# Altium project Hydra A1 UCLO 35131D.PrjPCB (part 6 of 14)
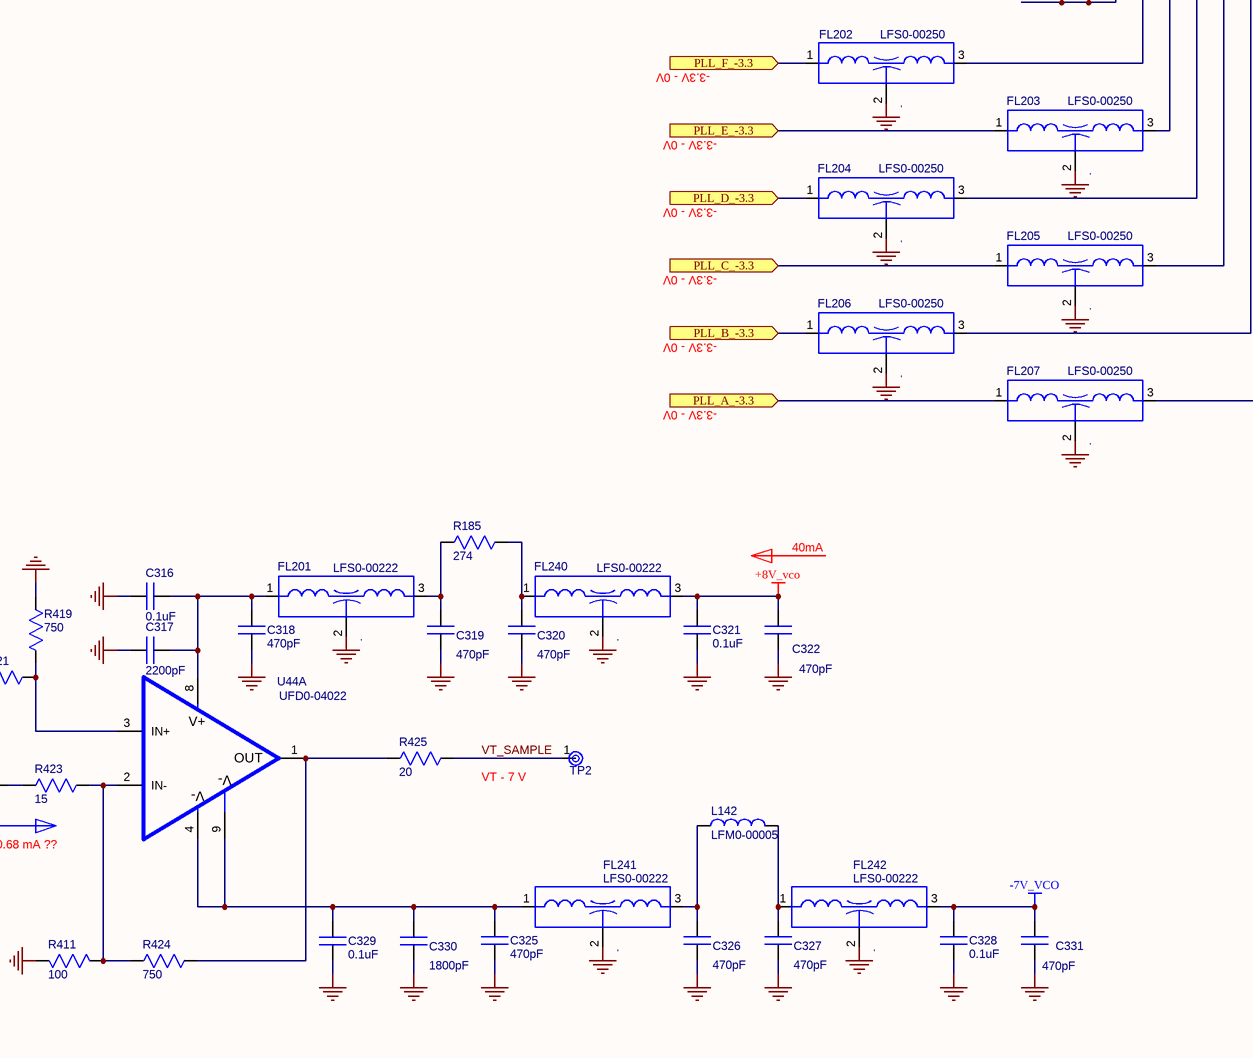
[diagram p73: Fast PLL.SchDoc, bottom right]

## Sheet Fast PLL.SchDoc: Fast PLL (continued)

### Library data of the parts
AT20 = MPFC-A1000: NoLoad: .; Approved: CL; M_PN: IMS1141-00DB; MFGR: IMS RESISTORS; level: 1; line_number: 50; ModifyDate: 4/16/13; G_PN: MPFC-A1000; item_number: MPFC-A1000
AT21 = MPFC-A1820: NoLoad: .; Approved: CL; MFGR: Aeroflex/Inmet; level: 1; line_number: 32; ModifyDate: 1/20/15; M_PN: MPFC-A1820; G_PN: MPFC-A1820; item_number: MPFC-A1820
C22 C294 C303 C461 = CK35-01470: MFGR: VENKEL; M_PN: C0201X7R250-471JNP; Approved: CL; NoLoad: .; level: 1; line_number: 112; ModifyDate: 7/23/13; G_PN: CK35-01470; item_number: CK35-01470
C23 C26 C30 C170 C223 C224 C229 C264 C270 C271 C273 C278 C280 C287 C289 C300 C302 C319 C320 C322 C326 C327 C331 C414 C415 C417 C462-C464 C1239 = CK40-01470: MFGR: Any; Approved: CL; NoLoad: .; level: 1; line_number: 75; ModifyDate: 02/22/12; M_PN: Any; G_PN: CK40-01470; item_number: CK40-01470
C27 C43 C44 C68 C92 C99 C127 C169 C221 C225 C228 C262 C275 C281 C288 C297 C298 C306 C307 C310 C311 C315 C316 C321 C323 C328 C329 C362 C458 C459 C468 C470 C1210 = CK40-04100: Approved: CL; NoLoad: .; MFGR: VENKEL; M_PN: C0402X7R160-104KNP; level: 1; line_number: 95; ModifyDate: 3/29/13; G_PN: CK40-04100; item_number: CK40-04100
C31 C32 C42 C75 C98 C226 C244 C246 C269 C291 C299 C304 C313 C314 C363 C465 C467 C471 = CK40-01470: Approved: CL; NoLoad: .; MFGR: Any; level: 1; line_number: 75; G_PN: CK40-01470; ModifyDate: 02/22/12; M_PN: Any; item_number: CK40-01470
C33 C36 C39 C52 C53 C337 = CK41-00015: Approved: CL; NoLoad: .; M_PN: 600L1R5AT200; MFGR: ATC; level: 1; line_number: 170; G_PN: CK41-00015; ModifyDate: 02/09/13; item_number: CK41-00015
C34 C37 C46 C335 = CK41-00018: Approved: CL; NoLoad: .; M_PN: 600L1R8AT200; MFGR: ATC; level: 1; line_number: 175; G_PN: CK41-00018; ModifyDate: 02/09/13; item_number: CK41-00018
C35 C38 C332 C336 = CK41-00082: Approved: CL; NoLoad: .; M_PN: 600L8R2BT200; MFGR: ATC; level: 1; line_number: 180; G_PN: CK41-00082; ModifyDate: 4/23/12; item_number: CK41-00082
C40 C49 C50 C333 = CK41-00012: Approved: CL; NoLoad: .; M_PN: 600L1R2AT200; MFGR: ATC; level: 1; line_number: 195; G_PN: CK41-00012; ModifyDate: 02/22/13; item_number: CK41-00012
C41 C47 = CK41-00091: Approved: CL; NoLoad: .; M_PN: 600L9R1BT200; MFGR: ATC; level: 1; line_number: 200; G_PN: CK41-00091; ModifyDate: 3/221/12; item_number: CK41-00091
C45 C48 C334 = CK41-00068: Approved: CL; NoLoad: .; M_PN: 600L6R8BT200; MFGR: ATC; level: 1; line_number: 210; G_PN: CK41-00068; ModifyDate: 02/22/12; item_number: CK41-00068
C54-C56 C58 C339 = CK41-00006: Approved: CL; NoLoad: .; M_PN: 600L0R6AT200; MFGR: ATC; level: 1; line_number: 225; G_PN: CK41-00006; ModifyDate: 02/22/12; item_number: CK41-00006
C57 C338 = CK41-00008: Approved: CL; NoLoad: .; M_PN: 600L0R8AT200; MFGR: ATC; level: 1; line_number: 230; G_PN: CK41-00008; ModifyDate: 02/20/13; item_number: CK41-00008
C161 C364 C397 C1101 = CK35-00270: Approved: CL; NoLoad: .; MFGR: VENKEL; M_PN: C0201C0G500-270JNP; level: 1; line_number: 97; G_PN: CK35-00270; ModifyDate: 8/2/13; item_number: CK35-00270
C163 C406-C409 C418 = CK40-00270: Approved: CL; NoLoad: .; MFGR: ANY; level: 1; line_number: 215; G_PN: CK40-00270; ModifyDate: 02/22/12; M_PN: ANY; item_number: CK40-00270
C167 C242 C263 C272 C292 C305 C410 C411 C413 C460 C466 C1209 = CK45-14100: Approved: CL; NoLoad: .; MFGR: VENKEL; M_PN: C0603X7R500-104JNE; level: 1; line_number: 65; ModifyDate: 3/29/13; G_PN: CK45-14100; item_number: CK45-14100
C168 C266 C268 C277 C318 C325 C383 C384 C386 C404 C405 C442-C444 C455-C457 = CK35-01470: Approved: CL; NoLoad: .; MFGR: VENKEL; M_PN: C0201X7R250-471JNP; level: 1; line_number: 112; ModifyDate: 7/23/13; G_PN: CK35-01470; item_number: CK35-01470
C174 = CK40-01150: Approved: CL; NoLoad: .; MFGR: Any; level: 1; line_number: 100; G_PN: CK40-01150; ModifyDate: 2/1/14; M_PN: Any; item_number: CK40-01150
C219 C220 = CK40-00100: NoLoad: .; MFGR: ANY; Approved: CL; level: 1; line_number: 110; G_PN: CK40-00100; ModifyDate: 4/9/12; M_PN: ANY; item_number: CK40-00100
C243 C265 C267 C276 C296 C330 = CK40-02180: Approved: CL; NoLoad: .; MFGR: Any; level: 1; line_number: 135; G_PN: CK40-02180; ModifyDate: 02/22/12; M_PN: Any; item_number: CK40-02180
C247 C249 = CK41-00003: Approved: CL; NoLoad: .; M_PN: 600L0R3AT200T; MFGR: ATC; level: 1; line_number: 140; G_PN: CK41-00003; ModifyDate: 01/23/14; item_number: CK41-00003
C248 C250 C274 C282 C284 = CK41-00002: Approved: CL; NoLoad: .; M_PN: 600L0R2AT200; MFGR: ATC; level: 1; line_number: 145; G_PN: CK41-00002; ModifyDate: 02/14/13; item_number: CK41-00002
C251 C295 = CK35-00010: Approved: CL; NoLoad: .; M_PN: C0201C0G500-1R0BNP; MFGR: VENKEL; level: 1; line_number: 147; G_PN: CK35-00010; ModifyDate: 7/23/13; item_number: CK35-00010
C279 C286 = CK40-00270: Approved: CL; MFGR: ANY; NoLoad: .; level: 1; line_number: 215; ModifyDate: 02/22/12; G_PN: CK40-00270; M_PN: ANY; item_number: CK40-00270
C283 C285 = CK41-00004: Approved: CL; NoLoad: .; M_PN: 600L0R4AT200; MFGR: ATC; level: 1; line_number: 160; G_PN: CK41-00004; ModifyDate: 02/14/13; item_number: CK41-00004
C290 = CK45-01470: Approved: CL; NoLoad: .; MFGR: ANY; level: 1; line_number: 190; G_PN: CK45-01470; ModifyDate: 4/9/12; M_PN: ANY; item_number: CK45-01470
C293 C416 C1213 C1238 = CK45-04100: Approved: CL; NoLoad: .; MFGR: ANY; level: 1; line_number: 105; ModifyDate: 02/22/12; G_PN: CK45-04100; M_PN: ANY; item_number: CK45-04100
C308 C309 C312 C317 = CK35-02220: Approved: CL; NoLoad: .; MFGR: VENKEL; M_PN: C0201X7R250-222JNP; level: 1; line_number: 167; G_PN: CK35-02220; ModifyDate: 7/23/13; item_number: CK35-02220
C412 = CK40-01470: 470 PF;5%;COG;>50V;CHIP;0402; MFGR: Any; Approved: CL; level: 1; line_number: 75; ModifyDate: 02/22/12; M_PN: Any; NoLoad: .; G_PN: CK40-01470; item_number: CK40-01470
C469 = CK40-01470: 470 PF;5%;COG;>50V;CHIP;0402; Approved: CL; NoLoad: .; MFGR: Any; level: 1; line_number: 75; G_PN: CK40-01470; ModifyDate: 02/22/12; M_PN: Any; item_number: CK40-01470
C830 = CK35-00027: Approved: CL; NoLoad: .; MFGR: VENKEL; M_PN: C0201C0G500-2R7BNP; level: 1; line_number: 310; G_PN: CK35-00027; ModifyDate: 6/13/13; item_number: CK35-00027
C1208 = CF16-S5100: NoLoad: .; M_PN: ECP-U1C105MA5; MFGR: PANASONIC; Approved: CL; level: 1; line_number: 80; G_PN: CF16-S5100; ModifyDate: 02/22/12; item_number: CF16-S5100
C1211 C1212 = CT35-S6331: Approved: CL; NoLoad: .; MFGR: VISHAY; M_PN: TCJD336M035R0070; level: 1; line_number: 85; G_PN: CT35-S6331; ModifyDate: 4/30/12; item_number: CT35-S6331
CR20 = DSA2-02812: DUAL RF DIODE; SCHOTTKY;.4V@1MA; 1.2PF; SOT-23; NoLoad: .; MFGR: AVAGO; Approved: CL; level: 1; line_number: 330; Value: HSMS-2812; M_PN: HSMS-2812; ModifyDate: 3/6/12; G_PN: DSA2-02812; item_number: DSA2-02812
FL14 FL19 FL20 FL140 FL154 FL169 FL179-FL181 FL195 FL198 FL201 FL240-FL242 FL248-FL255 = LFS0-00222: Approved: CL; NoLoad: .; M_PN: NFE31PT222Z1E9BL; MFGR: MURATA; level: 1; line_number: 335; G_PN: LFS0-00222; ModifyDate: 02/22/12; Value: 2200pF; item_number: LFS0-00222
FL26 = LFS0-00222: Approved: CL; MFGR: MURATA; NoLoad: .; M_PN: NFE31PT222Z1E9BL; level: 1; line_number: 335; Value: 2200pF; G_PN: LFS0-00222; ModifyDate: 02/22/12; item_number: LFS0-00222
FL135 FL160 FL167 FL182 FL191 FL192 FL197 FL202-FL209 FL295 = LFS0-00250: Approved: NM; MFGR: MURATA; NoLoad: .; M_PN: NFL18ST207X1C3; level: 1; line_number: 415; Value: 25pF; G_PN: LFS0-00250; ModifyDate: 02/22/12; item_number: LFS0-00250
FL136 FL139 FL178 FL183 FL199 FL200 FL243 = LFS1-00222: 2200 PF FEED THRU FILTER 0603; Value: 2200pF; Approved: NM; MFGR: muRata; NoLoad: .; level: 1; line_number: 475; ModifyDate: 11/14/12; M_PN: NFM18CC222R1C3; G_PN: LFS1-00222; item_number: LFS1-00222
FL246 = MFH0-00880: MFGR: MINI-CIRCUITS; Approved: CL; Value: HFCN-880+; NoLoad: .; level: 1; line_number: 380; G_PN: MFH0-00880; ModifyDate: 7/5/12; item_number: MFH0-00880
FL247 = MFL0-01800: MFGR: MINI-CIRCUITS; Approved: NM; Value: LFCN-1800+; NoLoad: .; level: 1; line_number: 360; G_PN: MFL0-01800; ModifyDate: 11/17/12; item_number: MFL0-01800
FT2 FT3 FT13 FT27 FT29 = FromToNode: level: 1; Approved: *; G_PN: *; MFGR: *; Value: *
L21 L22 L39 L40 L44 L45 L49 L50 L119 L131 L132 L137 L139 L140 L142 L163 L173 = LFM0-00005: MFGR: MuRata; NoLoad: .; Approved: NM; M_PN: BLM18AG331SN1; level: 1; line_number: 570; ModifyDate: 10/24/12; G_PN: LFM0-00005; item_number: LFM0-00005
L23 L26 = LSA5-02870: M_PN: 0603HP-8N7XGLU; MFGR: COILCRAFT; NoLoad: .; Approved: CL; level: 1; line_number: 575; G_PN: LSA5-02870; ModifyDate: 02/22/13; item_number: LSA5-02870
L24 L27 L143 = LSA5-03150: MFGR: COILCRAFT; NoLoad: .; Approved: CL; M_PN: 0603HP-15NXGLU; level: 1; line_number: 540; G_PN: LSA5-03150; ModifyDate: 2/20/13; item_number: LSA5-03150
L25 L28 L144 = LSA5-02820: M_PN: 0603HP-8N2XGLU; MFGR: COILCRAFT; NoLoad: .; Approved: CL; level: 1; line_number: 545; G_PN: LSA5-02820; ModifyDate: 03/20/12; item_number: LSA5-02820
L29 L30 = LSA5-02680: M_PN: 0603HP-6N8XGLU; MFGR: COILCRAFT; NoLoad: .; Approved: CL; level: 1; line_number: 550; G_PN: LSA5-02680; ModifyDate: 2/20/13; item_number: LSA5-02680
L31 L34 L37 = LSA5-04150: MFGR: COILCRAFT; NoLoad: .; Approved: CL; M_PN: 0603HP-R15XGLU; level: 1; line_number: 555; G_PN: LSA5-04150; ModifyDate: 5/16/12; item_number: LSA5-04150
L32 L35 L38 = LSA5-03750: M_PN: 0603HP-75NXGLU; MFGR: COILCRAFT; NoLoad: .; Approved: CL; level: 1; line_number: 560; G_PN: LSA5-03750; ModifyDate: 02/22/12; item_number: LSA5-03750
L33 L36 = LSA5-03270: M_PN: 0603HP-27NXGLU; MFGR: COILCRAFT; NoLoad: .; Approved: CL; level: 1; line_number: 565; G_PN: LSA5-03270; ModifyDate: 3/11/13; item_number: LSA5-03270
L120 L121 L129 L130 L133-L136 = LSA6-02560: NoLoad: .; Approved: CL; M_PN: 0402HP-5N6XGLU; MFGR: COILCRAFT; level: 1; line_number: 595; G_PN: LSA6-02560; ModifyDate: 3/4/13; item_number: LSA6-02560
L145 L146 = LSA5-03180: M_PN: 0603HP-18NXGLU; MFGR: COILCRAFT; NoLoad: .; Approved: CL; level: 1; line_number: 605; G_PN: LSA5-03180; ModifyDate: 02/22/12; item_number: LSA5-03180
L172 = LSA3-14100: M_PN: 0603CS-R10XJBU; MFGR: COILCRAFT; NoLoad: .; Approved: CL; level: 1; line_number: 525; ModifyDate: 02/22/12; G_PN: LSA3-14100; item_number: LSA3-14100
L255 = LSA6-03220: M_PN: 0402HP-22NXGLU; MFGR: COILCRAFT; NoLoad: .; Approved: CL; level: 1; line_number: 546; G_PN: LSA6-03220; ModifyDate: 6/20/14; item_number: LSA6-03220
MTG35 MTG62-MTG66 MTG73 MTG78 MTG79 MTG96 MTG117-MTG146 MTG173-MTG177 = MHP200X92: level: 1; ModifyDate: 02/14/2008 14:07:19; Value: *
MTG103#2 MTG109 = MHP150X67: MHP200X92; level: 1; ModifyDate: 02/14/2008 14:07:19; Value: *
Q3 = QBNC-03904: .2A IC;40V;.3W;100-300HFE;300MHZ;SOT-23; NoLoad: .; Approved: CL; MFGR: ON SEMI; level: 1; line_number: 640; M_PN: MMBT3904LT1; Value: MMBT3904LT1; ModifyDate: 02/22/12; G_PN: QBNC-03904; item_number: QBNC-03904
R16 R172-R177 = RK40-00000: Approved: CL; NoLoad: .; MFGR: ANY; level: 1; line_number: 710; G_PN: RK40-00000; ModifyDate: 3/27/13; M_PN: ANY; item_number: RK40-00000
R56 = RK30-00221: Approved: CL; NoLoad: .; MFGR: Vishay-Dale; M_PN: CRCW020122R1FNED; level: 1; line_number: 965; G_PN: RK30-00221; ModifyDate: 2/26/14; item_number: RK30-00221
R63 = RK30-00000: Approved: CL; MFGR: Vishay-Dale; M_PN: CRCW02010000Z0ED; Value: 0 ohm; level: 1; line_number: 1003; G_PN: RK30-00000; ModifyDate: 8/2/13; item_number: RK30-00000
R108 = RK35-00150: Approved: CL; NoLoad: .; MFGR: ANY; level: 1; line_number: 915; G_PN: RK35-00150; ModifyDate: 02/22/13; M_PN: ANY; item_number: RK35-00150
R185 = RK41-02740: Approved: CL; NoLoad: .; MFGR: PANASONIC; M_PN: ERJ-3EKF2740V; level: 1; line_number: 722; G_PN: RK41-02740; ModifyDate: 7/24/14; item_number: RK41-02740
R254 R451 = RK35-03090: NoLoad: .; MFGR: ANY; Approved: CL; level: 1; line_number: 765; ModifyDate: 02/22/12; M_PN: ANY; G_PN: RK35-03090; item_number: RK35-03090
R270 R355 R412 = RK35-00200: Approved: CL; NoLoad: .; MFGR: ANY; level: 1; line_number: 780; G_PN: RK35-00200; ModifyDate: 02/22/12; M_PN: ANY; item_number: RK35-00200
R271 = RK30-00200: Approved: CL; NoLoad: .; MFGR: Vishay-Dale; M_PN: CRCW020120R0FNED; level: 1; line_number: 782; G_PN: RK30-00200; ModifyDate: 7/24/13; item_number: RK30-00200
R272 R290 = RK30-07500: NoLoad: .; MFGR: Vishay-Dale; M_PN: CRCW0201750RFKED; Approved: CL; level: 1; line_number: 725; G_PN: RK30-07500; ModifyDate: 7/25/13; item_number: RK30-07500
R273 R342-R344 R411 R427 R682 = RK30-01000: Approved: CL; NoLoad: .; MFGR: Vishay-Dala; M_PN: CRCW0201100RFKED; level: 1; line_number: 787; G_PN: RK30-01000; ModifyDate: 7/23/13; item_number: RK30-01000
R274 R285 = RK30-02000: Approved: CL; NoLoad: .; MFGR: Vishay-Dale; M_PN: CRCW0201200RFKED; level: 1; line_number: 788; G_PN: RK30-02000; ModifyDate: 7/25/13; item_number: RK30-02000
R276 = RK30-00274: Approved: CL; MFGR: KOA SPEER; M_PN: RK73H1HTTC27R4F; NoLoad: .; level: 1; line_number: 789; ModifyDate: 6/27/14; G_PN: RK30-00274; item_number: RK30-00274
R280 = RK30-02000: NoLoad: .; MFGR: Vishay-Dale; M_PN: CRCW0201200RFKED; Approved: CL; level: 1; line_number: 788; ModifyDate: 7/25/13; G_PN: RK30-02000; item_number: RK30-02000
R286 = RK40-04530: Approved: NM; NoLoad: .; MFGR: ANY; level: 1; line_number: 812; G_PN: RK40-04530; ModifyDate: 2/1/14; M_PN: ANY; item_number: RK40-04530
R287 = RK30-00000: Approved: CL; NoLoad: .; MFGR: Vishay-Dale; M_PN: CRCW02010000Z0ED; level: 1; line_number: 1003; G_PN: RK30-00000; ModifyDate: 8/2/13; item_number: RK30-00000
R288 = RK35-00174: NoLoad: .; Approved: CL; MFGR: ANY; level: 1; line_number: 815; G_PN: RK35-00174; ModifyDate: 02/22/12; M_PN: ANY; item_number: RK35-00174
R329 R330 = RK30-11500: Approved: CL; NoLoad: .; MFGR: Vishay-Dale; M_PN: CRCW02011K50FKED; level: 1; line_number: 840; G_PN: RK30-11500; ModifyDate: 7/29/13; item_number: RK30-11500
R331 R336 = RK35-R0549: Approved: CL; NoLoad: .; MFGR: ANY; level: 1; line_number: 845; G_PN: RK35-R0549; ModifyDate: 07/30/12; M_PN: ANY; item_number: RK35-R0549
R332 R338 = RK35-02940: NoLoad: .; Approved: CL; MFGR: ANY; level: 1; line_number: 847; G_PN: RK35-02940; ModifyDate: 02/22/12; M_PN: ANY; item_number: RK35-02940
R334 R335 R1269 = RK35-02000: Approved: CL; NoLoad: .; MFGR: ANY; level: 1; line_number: 790; G_PN: RK35-02000; ModifyDate: 02/22/12; M_PN: ANY; item_number: RK35-02000
R339 = RK35-00499: Approved: CL; NoLoad: .; MFGR: ANY; level: 1; line_number: 650; ModifyDate: 02/22/12; G_PN: RK35-00499; M_PN: ANY; item_number: RK35-00499
R340 = TRC3-00500: Approved: CL; NoLoad: .; MFGR: ANY; level: 1; line_number: 860; G_PN: TRC3-00500; ModifyDate: 02/27/13; M_PN: ANY; item_number: TRC3-00500
R341 R428 = RK35-04320: NoLoad: .; MFGR: ANY; Approved: CL; level: 1; line_number: 865; G_PN: RK35-04320; ModifyDate: 02/22/12; M_PN: ANY; item_number: RK35-04320
R352 = RK35-07500: NoLoad: .; MFGR: ANY; Approved: CL; level: 1; line_number: 785; G_PN: RK35-07500; M_PN: ANY; ModifyDate: 4/11/12; item_number: RK35-07500
R353 = RK35-07870: NoLoad: .; MFGR: ANY; Approved: CL; level: 1; line_number: 870; G_PN: RK35-07870; M_PN: ANY; ModifyDate: 2/22/13; item_number: RK35-07870
R354 = RK30-12000: NoLoad: .; MFGR: Vishay-Dale; M_PN: CRCW02012K00FKED; Approved: CL; level: 1; line_number: 872; G_PN: RK30-12000; ModifyDate: 7/31/13; item_number: RK30-12000
R356 = RK35-00274: NoLoad: .; Approved: CL; MFGR: ANY; level: 1; line_number: 875; G_PN: RK35-00274; ModifyDate: 2/22/13; M_PN: ANY; item_number: RK35-00274
R357 = RK35-03320: NoLoad: .; MFGR: ANY; Approved: CL; level: 1; line_number: 897; G_PN: RK35-03320; M_PN: ANY; ModifyDate: 4/9/12; item_number: RK35-03320
R358 R777 = RK35-01500: NoLoad: .; Approved: CL; MFGR: ANY; level: 1; line_number: 850; G_PN: RK35-01500; ModifyDate: 02/22/12; M_PN: ANY; item_number: RK35-01500
R410 = RK30-02210: NoLoad: .; MFGR: Vishay-Dale; M_PN: CRCW0201200RFKED; Approved: CL; level: 1; line_number: 908; G_PN: RK30-02210; ModifyDate: 2/26/14; item_number: RK30-02210
R415 = RK30-21000: Approved: CL; NoLoad: .; MFGR: Vishay-Dale; M_PN: CRCW020110K0FKED; level: 1; line_number: 905; G_PN: RK30-21000; ModifyDate: 7/31/13; item_number: RK30-21000
R419 R424 = RK30-07500: NoLoad: .; Approved: CL; MFGR: Vishay-Dale; M_PN: CRCW0201750RFKED; level: 1; line_number: 725; G_PN: RK30-07500; ModifyDate: 7/25/13; item_number: RK30-07500
R420 = RK35-16040: NoLoad: .; Approved: CL; MFGR: ANY; level: 1; line_number: 910; G_PN: RK35-16040; ModifyDate: 4/11/12; M_PN: ANY; item_number: RK35-16040
R421 = RK30-00150: Approved: CL; NoLoad: .; M_PN: CRCW020115R0FNED; MFGR: Vishay-Dale; level: 1; line_number: 911; G_PN: RK30-00150; ModifyDate: 2/26/14; item_number: RK30-00150
R422 = RK30-11270: NoLoad: .; Approved: CL; MFGR: Vishay-Dale; M_PN: CRCW02011K27FKED; level: 1; line_number: 898; G_PN: RK30-11270; ModifyDate: 7/30/13; item_number: RK30-11270
R423 = RK40-00150: Approved: CL; NoLoad: .; M_PN: ANY; level: 1; line_number: 912; G_PN: RK40-00150; ModifyDate: 7/30/13; MFGR: ANY; item_number: RK40-00150
R425 = RK30-00200: Approved: CL; MFGR: Vishay-Dale; M_PN: CRCW020120R0FNED; NoLoad: .; level: 1; line_number: 782; ModifyDate: 7/24/13; G_PN: RK30-00200; item_number: RK30-00200
R426 = RK35-11000: NoLoad: .; Approved: CL; MFGR: ANY; level: 1; line_number: 1025; G_PN: RK35-11000; ModifyDate: 02/22/12; M_PN: ANY; item_number: RK35-11000
R450 = RK35-00162: Approved: CL; NoLoad: .; M_PN: ANY; level: 1; line_number: 935; G_PN: RK35-00162; ModifyDate: 02/28/13; MFGR: ANY; item_number: RK35-00162
R452 R454 = RK35-00768: Approved: CL; NoLoad: .; MFGR: ANY; level: 1; line_number: 940; G_PN: RK35-00768; ModifyDate: 2/28/113; M_PN: ANY; item_number: RK35-00768
R453 = RK35-01130: NoLoad: .; MFGR: ANY; Approved: CL; level: 1; line_number: 945; ModifyDate: 02/28/13; G_PN: RK35-01130; M_PN: ANY; item_number: RK35-01130
R455 = RK65-00511: NoLoad: .; Approved: CL; MFGR: VISHAY/DALE; M_PN: CRCW201040R2FKEF; level: 1; line_number: 950; G_PN: RK65-00511; ModifyDate: 2/28/13; item_number: RK65-00511
R776 R778 = RK35-11000: Approved: CL; NoLoad: .; MFGR: ANY; level: 1; line_number: 1025; G_PN: RK35-11000; ModifyDate: 02/22/12; M_PN: ANY; item_number: RK35-11000
R779 = RK35-12000: Approved: CL; NoLoad: .; MFGR: ANY; level: 1; line_number: 660; G_PN: RK35-12000; ModifyDate: 02/22/12; M_PN: ANY; item_number: RK35-12000
R1337 = RK35-00475: NoLoad: .; Approved: CL; MFGR: ANY; level: 1; line_number: 712; G_PN: RK35-00475; ModifyDate: 4/9/12; M_PN: ANY; item_number: RK35-00475
SW1 = ULD0-00613: Value: DG613DY; MFGR: VISHAY; NoLoad: .; Approved: NM; level: 1; line_number: 1060; ModifyDate: 2/20/13; M_PN: DG613DY; G_PN: ULD0-00613; item_number: ULD0-00613
TP2 = ETS0-06303: Value: RCUCTE; MFGR: KOA; NoLoad: .; Approved: CL; level: 1; line_number: 1093; M_PN: RCUCTE; ModifyDate: 5/24/12; G_PN: ETS0-06303; item_number: ETS0-06303
U41 = UTD4-00329: NoLoad: .; Approved: CL; MFGR: ON SEMI; level: 1; line_number: 1220; Value: M74VHC1GT32DFT1G; G_PN: UTD4-00329; ModifyDate: 6/21/14; M_PN: M74VHC1GT32DFT1G; item_number: UTD4-00329
U44 = UFD0-04022: Value: THS4022CDGN; NoLoad: .; Approved: NM; MFGR: Texas Instruments; level: 1; line_number: 1231; ModifyDate: 6/18/14; G_PN: UFD0-04022; M_PN: THS4022CDGN; item_number: UFD0-04022
U46 = UID0-09748: MFGR: ANALOG DEVICES; Approved: NM; NoLoad: .; level: 1; line_number: 1240; ModifyDate: 12/05/12; G_PN: UID0-09748; item_number: UID0-09748
U73 = MYVT-00612: MFGR: Hittite; NoLoad: .; Approved: NM; M_PN: HMC732LC4B; level: 1; line_number: 1295; Value: *; ModifyDate: 10/27/12; G_PN: MYVT-00612; item_number: MYVT-00612
U74 = UFD0-03202: Value: LM393M; NoLoad: .; Approved: NM; MFGR: Texas Instruments; M_PN: THS3202; level: 1; line_number: 1235; ModifyDate: 12/04/12; G_PN: UFD0-03202; item_number: UFD0-03202
U75 = UID0-00439: DIG PHASE-FREQ DET;10-1300MHz;QS-16; M_PN: HMC439QS16G; Value: HMC439QS16G; NoLoad: .; Approved: CL; MFGR: HITTITE; level: 1; line_number: 1300; ModifyDate: 5/31/13; G_PN: UID0-00439; item_number: UID0-00439
U86 = UID0-00794: Value: HMC794LP3E; NoLoad: .; Approved: NM; MFGR: Hittite; level: 1; line_number: 1325; G_PN: UID0-00794; ModifyDate: 2/25/13; M_PN: HMC794LP3E; item_number: UID0-00794
U87 = UID0-00149: NoLoad: .; Approved: NM; MFGR: CENTELLAX; M_PN: UXN14M9P; level: 1; line_number: 1330; ModifyDate: 11/19/12; Value: UID0-00149; G_PN: UID0-00149; item_number: UID0-00149
U88 = MCS0-02541: NoLoad: .; MFGR: ANY; M_PN: IPS2541-C; Approved: CL; Value: IPS2541-C; level: 1; line_number: 1335; G_PN: MCS0-02541; ModifyDate: 2/27/13; item_number: MCS0-02541
U119 = MA13-06289: Value: SGA6289Z; NoLoad: .; Approved: CL; MFGR: RFMD; level: 1; line_number: 1125; ModifyDate: 2/28/13; G_PN: MA13-06289; item_number: MA13-06289
U167 = UFD0-04004: MFGR: ANALOG DEVICES; NoLoad: .; Approved: CL; Value: ADA4004-1ARJZ-R7; level: 1; line_number: 1145; ModifyDate: 5/12/13; M_PN: ADA4004-1ARJZ-R7; G_PN: UFD0-04004; item_number: UFD0-04004
X3 = LTR3-S0104: M_PN: TC4-25+; NoLoad: .; MFGR: MINICIRCUITS; Approved: CL; Value: TC4-25+; level: 1; line_number: 1075; ModifyDate: 2/25/13; G_PN: LTR3-S0104; item_number: LTR3-S0104
X4 = LTR2-S0104: M_PN: TCM4-6T+; NoLoad: .; MFGR: MINICIRCUITS; Approved: CL; Value: TCM4-6T+; level: 1; line_number: 1080; ModifyDate: 2/25/13; G_PN: LTR2-S0104; item_number: LTR2-S0104

## Sheet A1-A1 Switches Control Logic.SchDoc: A1-A1 Switches Control Logic
size D; DrawnBy: C. Lewis; Engineer: C. Lewis; Address1: 4650 NORRIS CANYON RD.; Address2: SAN RAMON, CA 94583; DocumentNumber: 35133; Revision: D; SheetNumber: 3; SheetTotal: 20
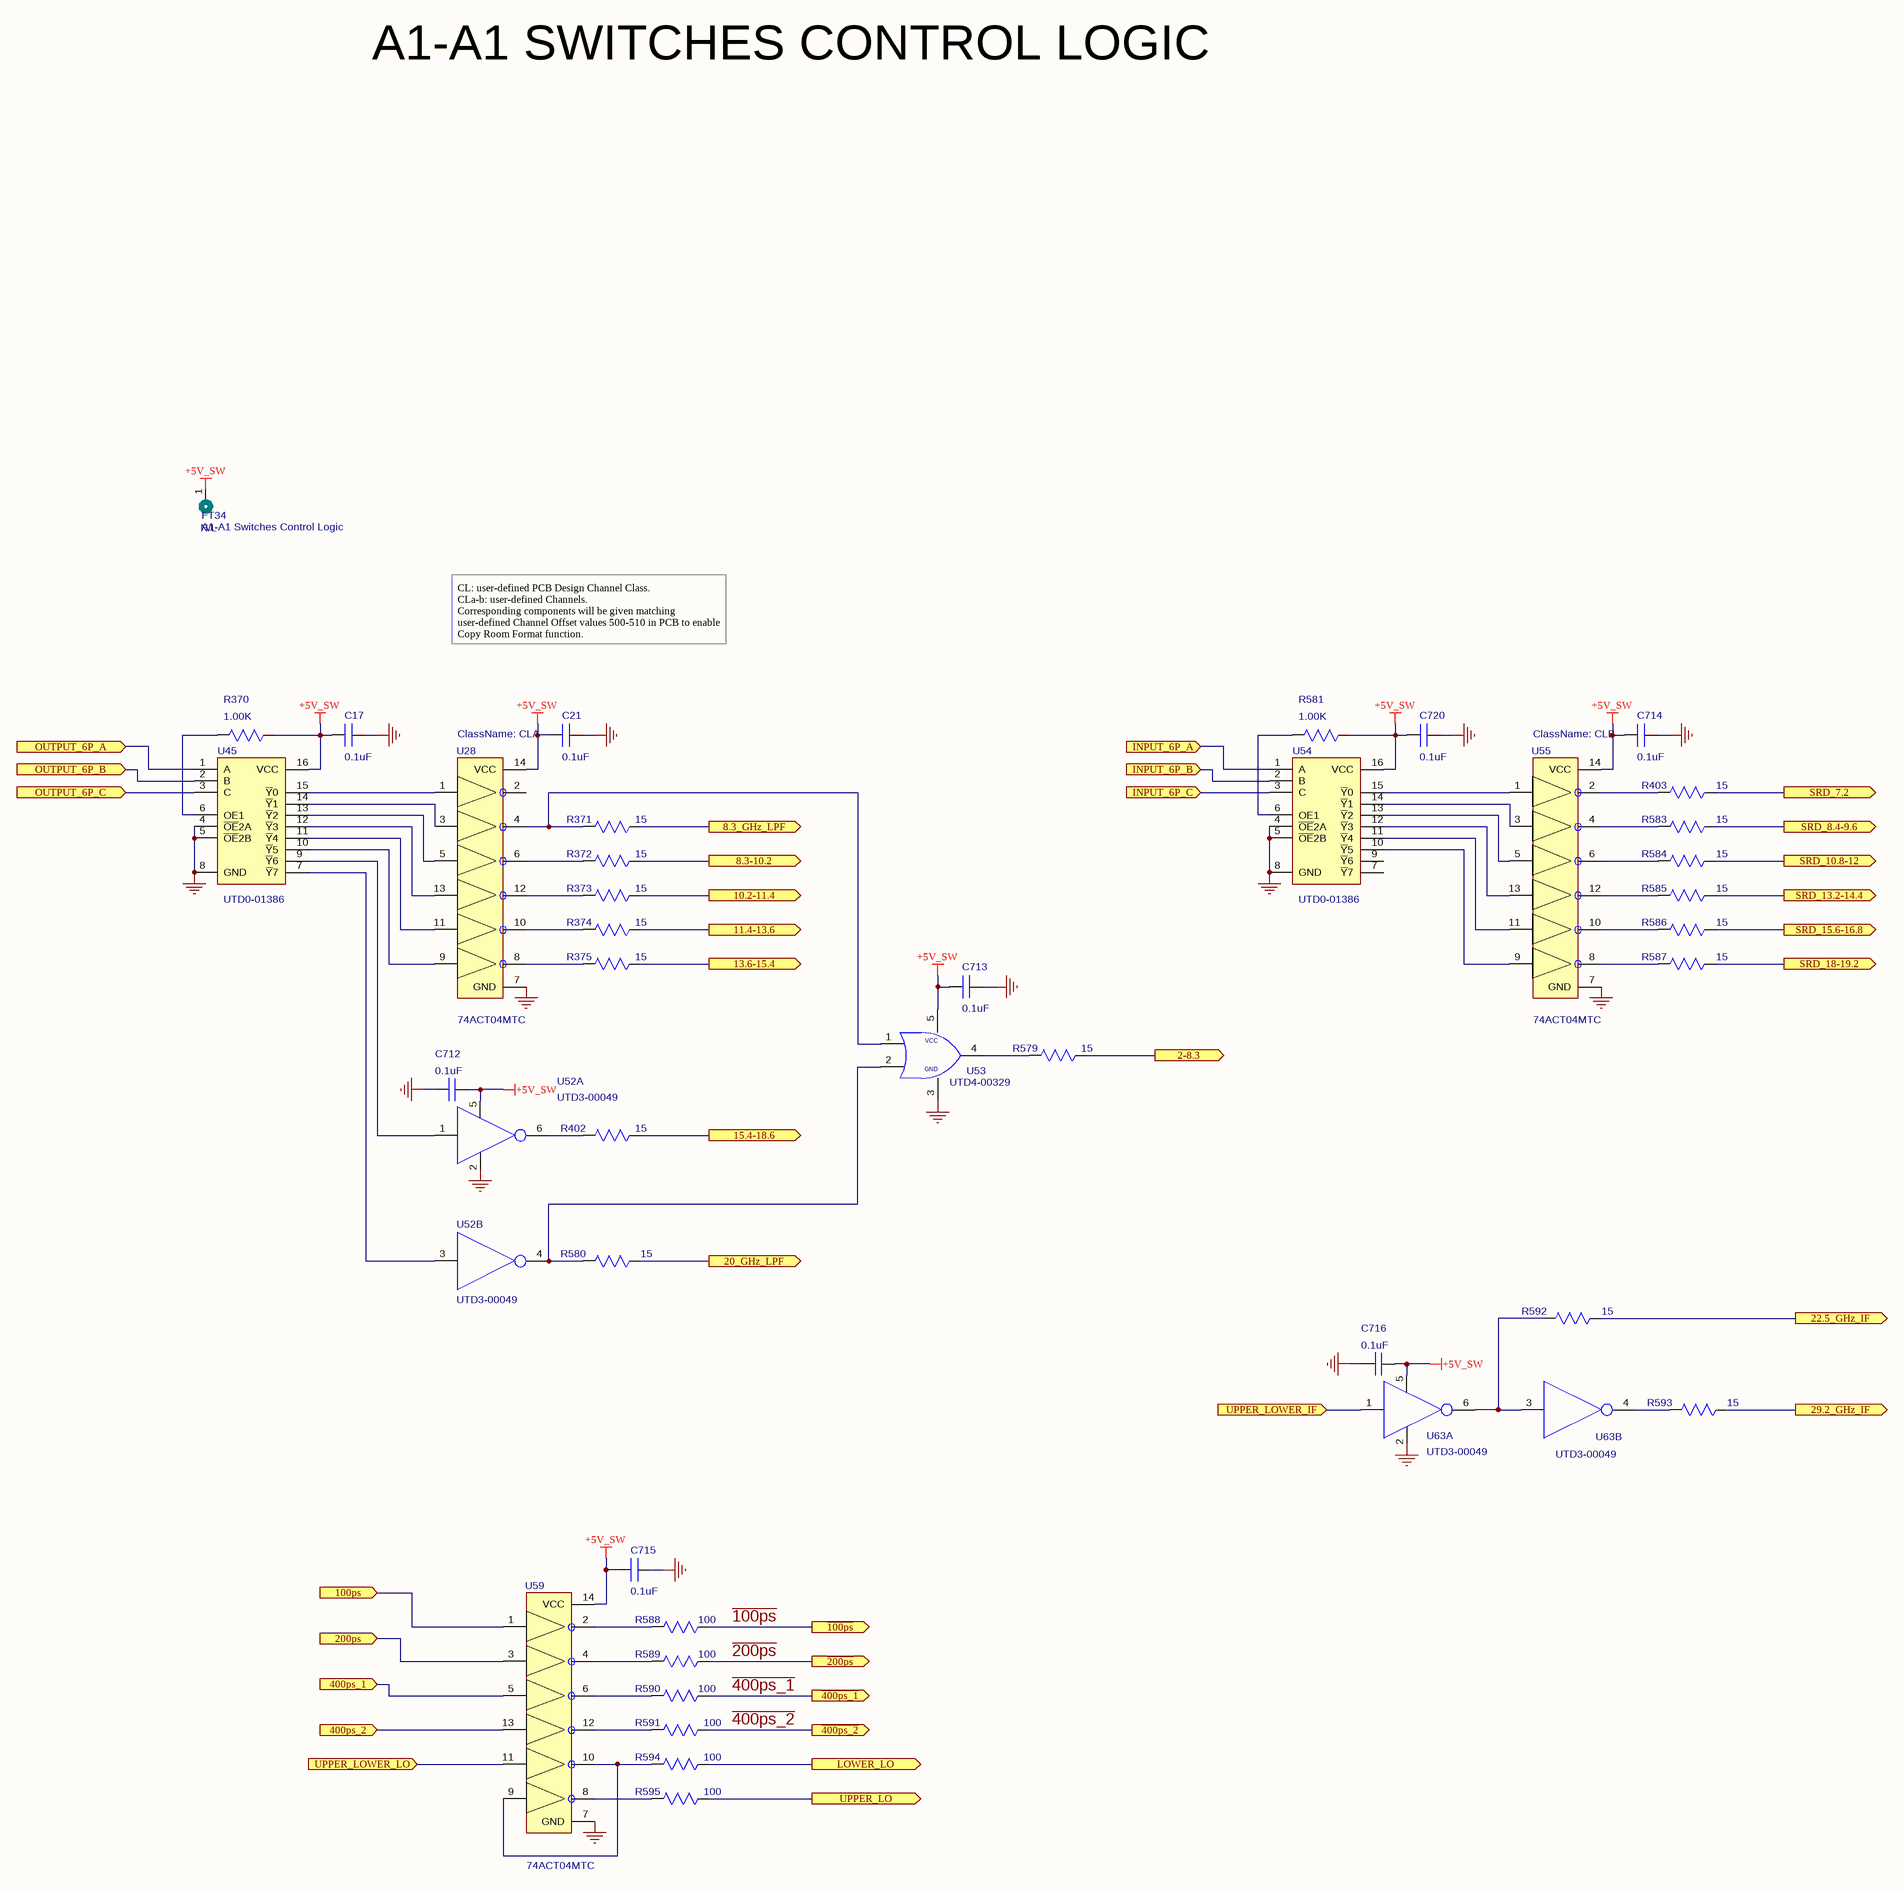
[diagram p28: A1-A1 Switches Control Logic.SchDoc]

### Parts
C17  value 0.1uF  [CAP-0603-H035-N]  (hidden comment: .1UF;10%;X7R;16V;CHIP;0603)
C21  value 0.1uF  [CAP-0603-H035-N]  (hidden comment: .1UF;10%;X7R;16V;CHIP;0603)
C712  value 0.1uF  [CAP-0603-H035-N]  (hidden comment: .1UF;10%;X7R;16V;CHIP;0603)
C713  value 0.1uF  [CAP-0603-H035-N]  (hidden comment: .1UF;10%;X7R;16V;CHIP;0603)
C714  value 0.1uF  [CAP-0603-H035-N]  (hidden comment: .1UF;10%;X7R;16V;CHIP;0603)
C715  value 0.1uF  [CAP-0603-H035-N]  (hidden comment: .1UF;10%;X7R;16V;CHIP;0603)
C716  value 0.1uF  [CAP-0603-H035-N]  (hidden comment: .1UF;10%;X7R;16V;CHIP;0603)
C720  value 0.1uF  [CAP-0603-H035-N]  (hidden comment: .1UF;10%;X7R;16V;CHIP;0603)
FT34  A1-A1 Switches Control Logic  NoLoad: N/L  [FromToNode_ML2]  (net tie, no BOM)
R370  value 1.00K  [RES-0402-N]  (hidden comment: 1.0K OHMS;.06W;1%;200PPM;FILM;CHIP;0402)
R371  value 15  [RES-0402-N]  (hidden comment: 15 OHMS;.06W;1%;200PPM;FILM;CHIP;0402)
R372  value 15  [RES-0402-N]  (hidden comment: 15 OHMS;.06W;1%;200PPM;FILM;CHIP;0402)
R373  value 15  [RES-0402-N]  (hidden comment: 15 OHMS;.06W;1%;200PPM;FILM;CHIP;0402)
R374  value 15  [RES-0402-N]  (hidden comment: 15 OHMS;.06W;1%;200PPM;FILM;CHIP;0402)
R375  value 15  [RES-0402-N]  (hidden comment: 15 OHMS;.06W;1%;200PPM;FILM;CHIP;0402)
R402  value 15  [RES-0402-N]  (hidden comment: 15 OHMS;.06W;1%;200PPM;FILM;CHIP;0402)
R403  value 15  [RES-0402-N]  (hidden comment: 15 OHMS;.06W;1%;200PPM;FILM;CHIP;0402)
R579  value 15  [RES-0402-N]  (hidden comment: 15 OHMS;.06W;1%;200PPM;FILM;CHIP;0402)
R580  value 15  [RES-0402-N]  (hidden comment: 15 OHMS;.06W;1%;200PPM;FILM;CHIP;0402)
R581  value 1.00K  [RES-0402-N]  (hidden comment: 1.0K OHMS;.06W;1%;200PPM;FILM;CHIP;0402)
R583  value 15  [RES-0402-N]  (hidden comment: 15 OHMS;.06W;1%;200PPM;FILM;CHIP;0402)
R584  value 15  [RES-0402-N]  (hidden comment: 15 OHMS;.06W;1%;200PPM;FILM;CHIP;0402)
R585  value 15  [RES-0402-N]  (hidden comment: 15 OHMS;.06W;1%;200PPM;FILM;CHIP;0402)
R586  value 15  [RES-0402-N]  (hidden comment: 15 OHMS;.06W;1%;200PPM;FILM;CHIP;0402)
R587  value 15  [RES-0402-N]  (hidden comment: 15 OHMS;.06W;1%;200PPM;FILM;CHIP;0402)
R588  value 100  [RES-0402-N]  (hidden comment: 100 OHMS; 1%; .1W; 100PPM; FILM; CHIP; 0402)
R589  value 100  [RES-0402-N]  (hidden comment: 100 OHMS; 1%; .1W; 100PPM; FILM; CHIP; 0402)
R590  value 100  [RES-0402-N]  (hidden comment: 100 OHMS; 1%; .1W; 100PPM; FILM; CHIP; 0402)
R591  value 100  [RES-0402-N]  (hidden comment: 100 OHMS; 1%; .1W; 100PPM; FILM; CHIP; 0402)
R592  value 15  [RES-0402-N]  (hidden comment: 15 OHMS;.06W;1%;200PPM;FILM;CHIP;0402)
R593  value 15  [RES-0402-N]  (hidden comment: 15 OHMS;.06W;1%;200PPM;FILM;CHIP;0402)
R594  value 100  [RES-0402-N]  (hidden comment: 100 OHMS; 1%; .1W; 100PPM; FILM; CHIP; 0402)
R595  value 100  [RES-0402-N]  (hidden comment: 100 OHMS; 1%; .1W; 100PPM; FILM; CHIP; 0402)
U28  M_PN: 74ACT04MTC  ClassName: CLA  [TSOP65P640X120-14L]  (hidden comment: 74ACT04MTC HEX INVERTER;SMT;TSSOP-14)
U45  UTD0-01386  [SOIC16_MS-012]
U52  INVERTER;DUAL;1.65-5.5V SUP;2NS TPD;SC70-6  [SOT-363_419B]  (value not drawn)  (parts A,B of 2)
U53  M74VHC1GT32DFT1G SGL OR SOT-353 RoHS  [SOT-353_ONSEMI]  (value not drawn)
U54  UTD0-01386  [SOIC16_MS-012]
U55  M_PN: 74ACT04MTC  ClassName: CLB  [TSOP65P640X120-14L]  (hidden comment: 74ACT04MTC HEX INVERTER;SMT;TSSOP-14)
U59  M_PN: 74ACT04MTC  [TSOP65P640X120-14L]  (hidden comment: 74ACT04MTC HEX INVERTER;SMT;TSSOP-14)
U63  INVERTER;DUAL;1.65-5.5V SUP;2NS TPD;SC70-6  [SOT-363_419B]  (value not drawn)  (parts A,B of 2)

### Ports
2-8.3, 8.3-10.2, 8.3_GHz_LPF, 10.2-11.4, 11.4-13.6, 13.6-15.4, 15.4-18.6, 20_GHz_LPF, 22.5_GHz_IF, 29.2_GHz_IF, 100ps, 200ps, 400ps_1, 400ps_2, INPUT_6P_A, INPUT_6P_B, INPUT_6P_C, LOWER_LO, OUTPUT_6P_A, OUTPUT_6P_B, OUTPUT_6P_C, SRD_7.2, SRD_8.4-9.6, SRD_10.8-12, SRD_13.2-14.4, SRD_15.6-16.8, SRD_18-19.2, UPPER_LO, UPPER_LOWER_IF, UPPER_LOWER_LO, ~{100ps}, ~{200ps}, ~{400ps_1}, ~{400ps_2}

### Nets
+5V_SW: C17.1 C21.1 C712.1 C713.1 C714.1 C715.1 C716.1 C720.1 FT34.1 R370.2 R581.2 U28.14(VCC) U45.16(VCC) U52.5(V+) U53.5(VCC) U54.16(VCC) U55.14(VCC) U59.14(VCC) U63.5(V+)
GND: C17.2 C21.2 C712.2 C713.2 C714.2 C715.2 C716.2 C720.2 U28.7(GND) U45.4(~{OE}2A) U45.5(~{OE}2B) U45.8(GND) U52.2(V-) U53.3(GND) U54.4(~{OE}2A) U54.5(~{OE}2B) U54.8(GND) U55.7(GND) U59.7(GND) U63.2(V-)
~{100ps}: R588.2 ; port ~{100ps}
2-8.3: R579.2 ; port 2-8.3
~{200ps}: R589.2 ; port ~{200ps}
~{400ps_1}: R590.2 ; port ~{400ps_1}
~{400ps_2}: R591.2 ; port ~{400ps_2}
8.3-10.2: R372.2 ; port 8.3-10.2
8.3_GHz_LPF: R371.2 ; port 8.3_GHz_LPF
10.2-11.4: R373.2 ; port 10.2-11.4
11.4-13.6: R374.2 ; port 11.4-13.6
13.6-15.4: R375.2 ; port 13.6-15.4
15.4-18.6: R402.2 ; port 15.4-18.6
20_GHz_LPF: R580.2 ; port 20_GHz_LPF
22.5_GHz_IF: R592.2 ; port 22.5_GHz_IF
29.2_GHz_IF: R593.2 ; port 29.2_GHz_IF
400ps_2: U59.13 ; port 400ps_2
LOWER_LO: R594.2 ; port LOWER_LO
SRD_7.2: R403.2 ; port SRD_7.2
SRD_8.4-9.6: R583.2 ; port SRD_8.4-9.6
SRD_10.8-12: R584.2 ; port SRD_10.8-12
SRD_13.2-14.4: R585.2 ; port SRD_13.2-14.4
SRD_15.6-16.8: R586.2 ; port SRD_15.6-16.8
SRD_18-19.2: R587.2 ; port SRD_18-19.2
UPPER_LO: R595.2 ; port UPPER_LO
NetR370_1: R370.1 U45.6(OE1)
NetR371_1: R371.1 U28.4 U53.1(B)
NetR372_1: R372.1 U28.6
NetR373_1: R373.1 U28.12
NetR374_1: R374.1 U28.10
NetR375_1: R375.1 U28.8
NetR402_1: R402.1 U52.6(OUT)
NetR403_1: R403.1 U55.2
NetR507_2: U59.1 ; port 100ps
NetR508_2: U59.3 ; port 200ps
NetR509_2: U59.5 ; port 400ps_1
NetR565_2: U59.11 ; port UPPER_LOWER_LO
NetR567_2: U54.1(A) ; port INPUT_6P_A
NetR568_2: U54.2(B) ; port INPUT_6P_B
NetR569_2: U54.3(C) ; port INPUT_6P_C
NetR571_2: U63.1(IN) ; port UPPER_LOWER_IF
NetR575_2: U45.1(A) ; port OUTPUT_6P_A
NetR576_2: U45.2(B) ; port OUTPUT_6P_B
NetR577_2: U45.3(C) ; port OUTPUT_6P_C
NetR579_1: R579.1 U53.4(Y)
NetR580_1: R580.1 U52.4(OUT) U53.2(A)
NetR581_1: R581.1 U54.6(OE1)
NetR583_1: R583.1 U55.4
NetR584_1: R584.1 U55.6
NetR585_1: R585.1 U55.12
NetR586_1: R586.1 U55.10
NetR587_1: R587.1 U55.8
NetR588_1: R588.1 U59.2
NetR589_1: R589.1 U59.4
NetR590_1: R590.1 U59.6
NetR591_1: R591.1 U59.12
NetR592_1: R592.1 U63.3(IN) U63.6(OUT)
NetR593_1: R593.1 U63.4(OUT)
NetR594_1: R594.1 U59.9 U59.10
NetR595_1: R595.1 U59.8
NetU28_1: U28.1 U45.15(~{Y}0)
NetU28_3: U28.3 U45.14(~{Y}1)
NetU28_5: U28.5 U45.13(~{Y}2)
NetU28_9: U28.9 U45.10(~{Y}5)
NetU28_11: U28.11 U45.11(~{Y}4)
NetU28_13: U28.13 U45.12(~{Y}3)
NetU45_7: U45.7(~{Y}7) U52.3(IN)
NetU45_9: U45.9(~{Y}6) U52.1(IN)
NetU54_10: U54.10(~{Y}5) U55.9
NetU54_11: U54.11(~{Y}4) U55.11
NetU54_12: U54.12(~{Y}3) U55.13
NetU54_13: U54.13(~{Y}2) U55.5
NetU54_14: U54.14(~{Y}1) U55.3
NetU54_15: U54.15(~{Y}0) U55.1

Not connected (* = marked no-connect by the designer): U28 2; U54 7(~{Y}7) 9(~{Y}6)

### Notes on the sheet
- A1-A1 SWITCHES CONTROL LOGIC
- CL: user-defined PCB Design Channel Class.
  CLa-b: user-defined Channels.
  Corresponding components will be given matching user-defined Channel Offset values 500-510 in PCB to enable Copy Room Format function.
- Title
- Sheet Title
- PRINTED DOCUMENT IS CONSIDERED UNCONTROLLED. VERIFY REVISION IN PLM SYSTEM.
- THIS DOCUMENT CONTAINS PROPRIETARY INFORMATION. DESIGN RIGHTS BELONG TO GIGA-TRONICS AND MAY NOT BE REPRODUCED WITHOUT WRITTEN AUTHORIZATION FOR ANY REASON EXCEPT CALIBRATION, OPERATION AND MAINTENANCE.
- Size
- CAGE CODE
- Filename
- D
- Document Number
- 58900
- Date
- Sheet
- Rev
- of

### Library data of the parts
C17 C21 C712-C716 C720 = CK45-04100: as C293 on sheet Fast PLL; ModifyDate: 02/22/12; G_PN: CK45-04100; M_PN: ANY; item_number: CK45-04100
  C17 C21: ClassName: CLA
  C714 C720: ClassName: CLB
FT34 = FromToNode: level: 1; Approved: *; G_PN: *; MFGR: *; Value: *
R370 R581 = RK35-11000: as R776 on sheet Fast PLL; G_PN: RK35-11000; ModifyDate: 02/22/12; M_PN: ANY; item_number: RK35-11000
  R370: ClassName: CLA
  R581: ClassName: CLB
R371-R375 R402 R403 R579 R580 R583-R587 R592 R593 = RK35-00150: as R108 on sheet Fast PLL; G_PN: RK35-00150; ModifyDate: 02/22/13; M_PN: ANY; item_number: RK35-00150
  R371-R375: ClassName: CLA
  R403 R583-R587: ClassName: CLB
R588-R591 R594 R595 = RK35-01000: Approved: CL; NoLoad: .; MFGR: ANY; level: 1; line_number: 960; G_PN: RK35-01000; ModifyDate: 02/22/12; M_PN: ANY; item_number: RK35-01000
U28 U55 U59 = UTD4-00046: MFGR: Fairchild; NoLoad: .; Approved: NM; level: 1; line_number: 1175; Value: *; ModifyDate: 10/27/12; G_PN: UTD4-00046; item_number: UTD4-00046
U45 U54 = UTD0-01386: 3 TO 8 DECODER/DEMULTIPLEXER;74ACT138 LOGIC;SO-16; Approved: NM; MFGR: FAIRCHILD; M_PN: 74ACT138SC; NoLoad: .; level: 1; line_number: 1165; G_PN: UTD0-01386; ModifyDate: 11/8/12; Value: *; item_number: UTD0-01386
  U45: ClassName: CLA
  U54: ClassName: CLB
U52 U63 = UTD3-00049: Value: NL27WZ04DFT2G; NoLoad: .; Approved: CL; MFGR: ON SEMI; level: 1; line_number: 1250; ModifyDate: 02/22/12; M_PN: NL27WZ04DFT2G; G_PN: UTD3-00049; item_number: UTD3-00049
U53 = UTD4-00329: as U41 on sheet Fast PLL; Value: M74VHC1GT32DFT1G; G_PN: UTD4-00329; ModifyDate: 6/21/14; M_PN: M74VHC1GT32DFT1G; item_number: UTD4-00329

## Sheet Analog Mux.SchDoc: Analog Mux
size D; DrawnBy: C. Lewis; Engineer: C. Lewis; Address1: 4650 NORRIS CANYON RD.; Address2: SAN RAMON, CA 94583; DocumentNumber: 35133; Revision: D; SheetNumber: 9; SheetTotal: 20; ProjectName: HYDRA
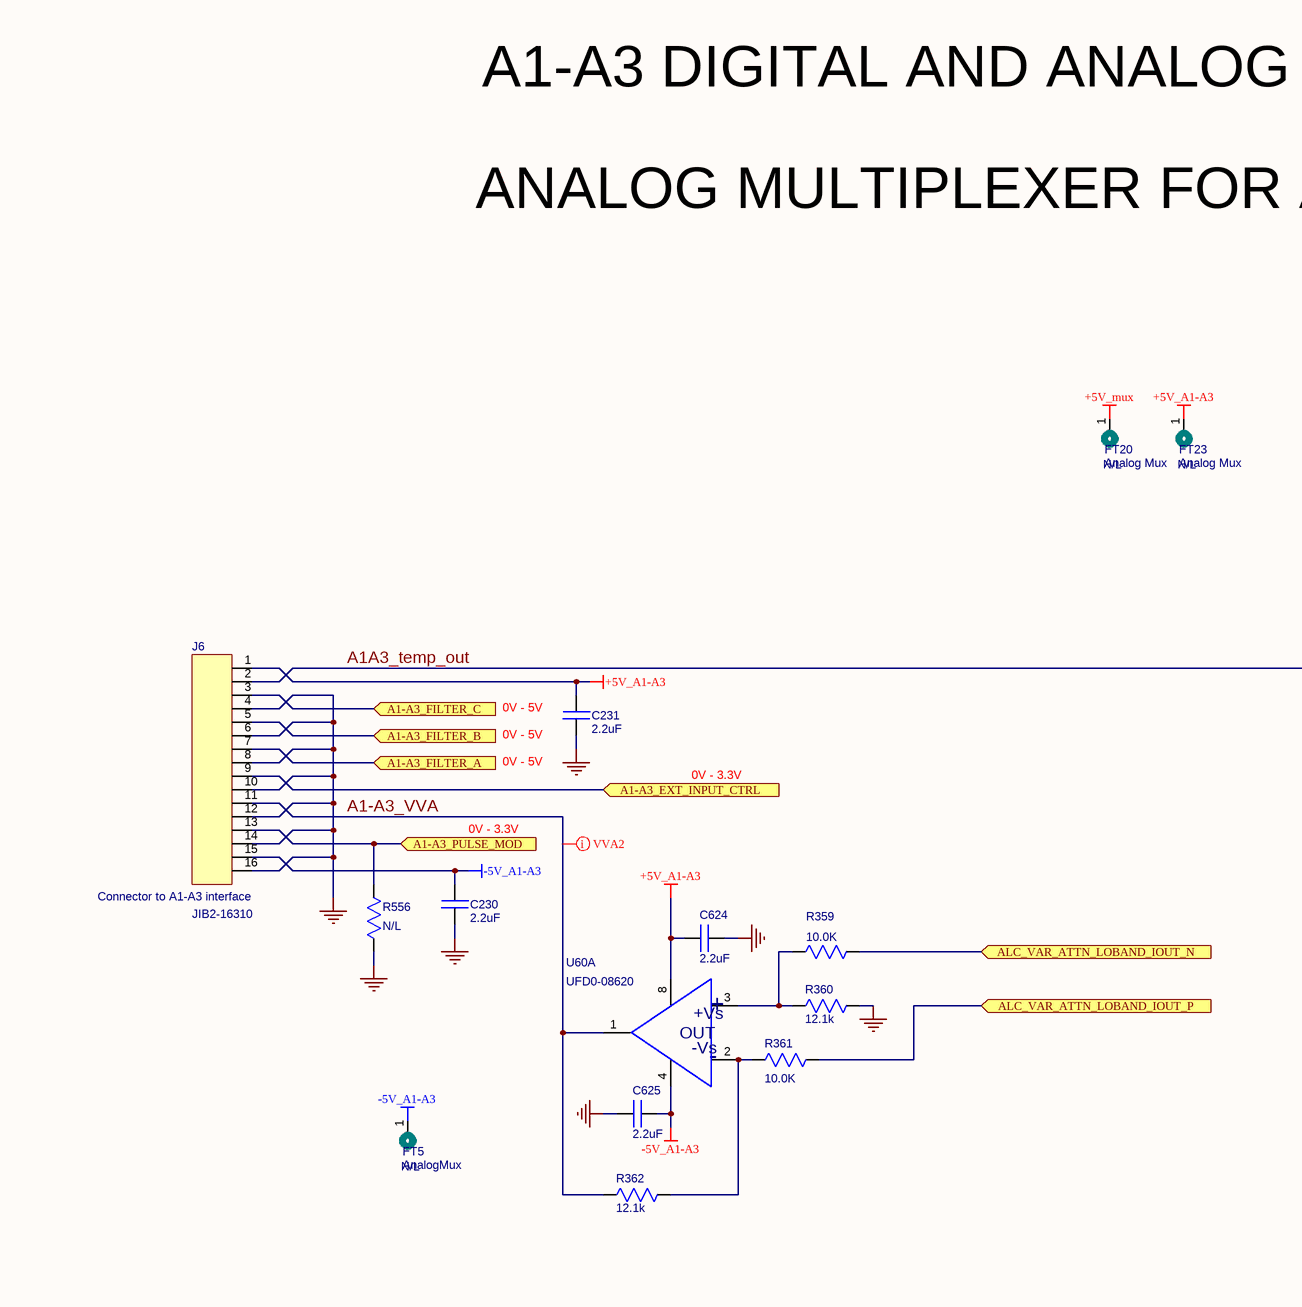
[diagram p29: Analog Mux.SchDoc, top left]
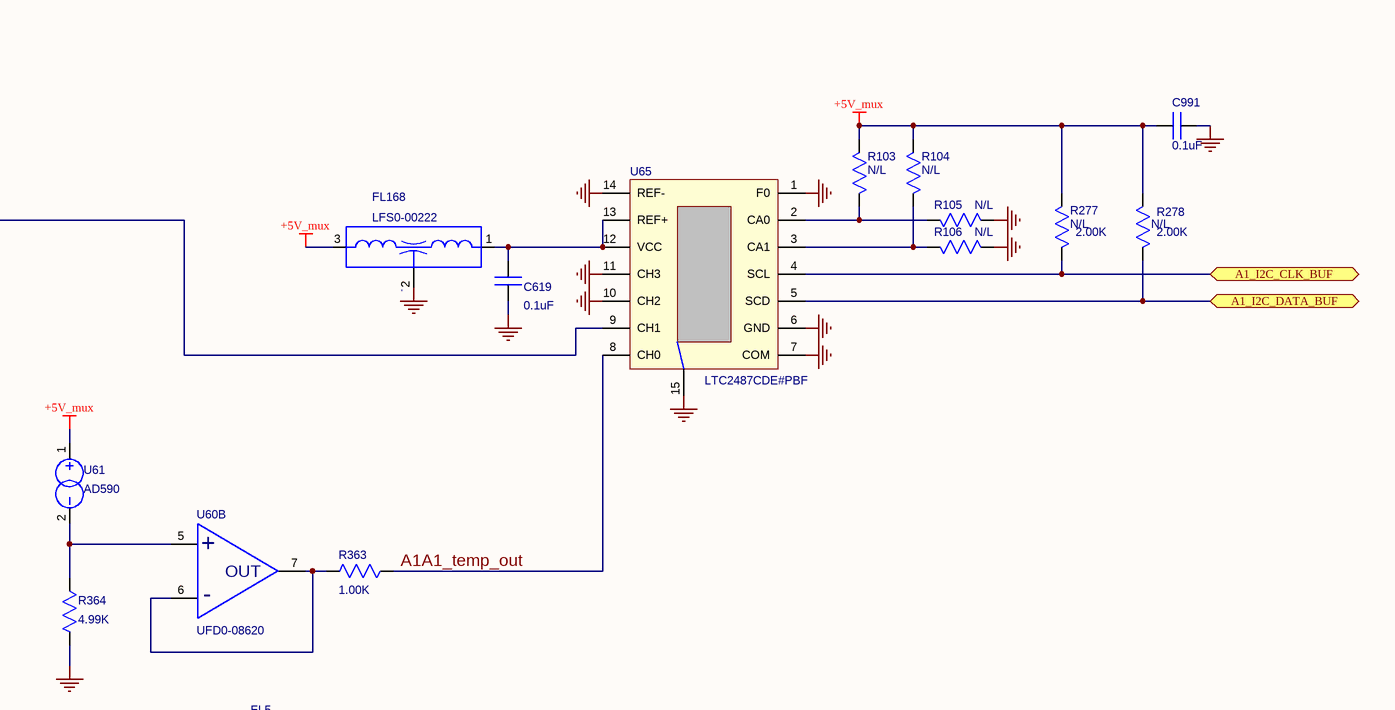
[diagram p30: Analog Mux.SchDoc, top right]
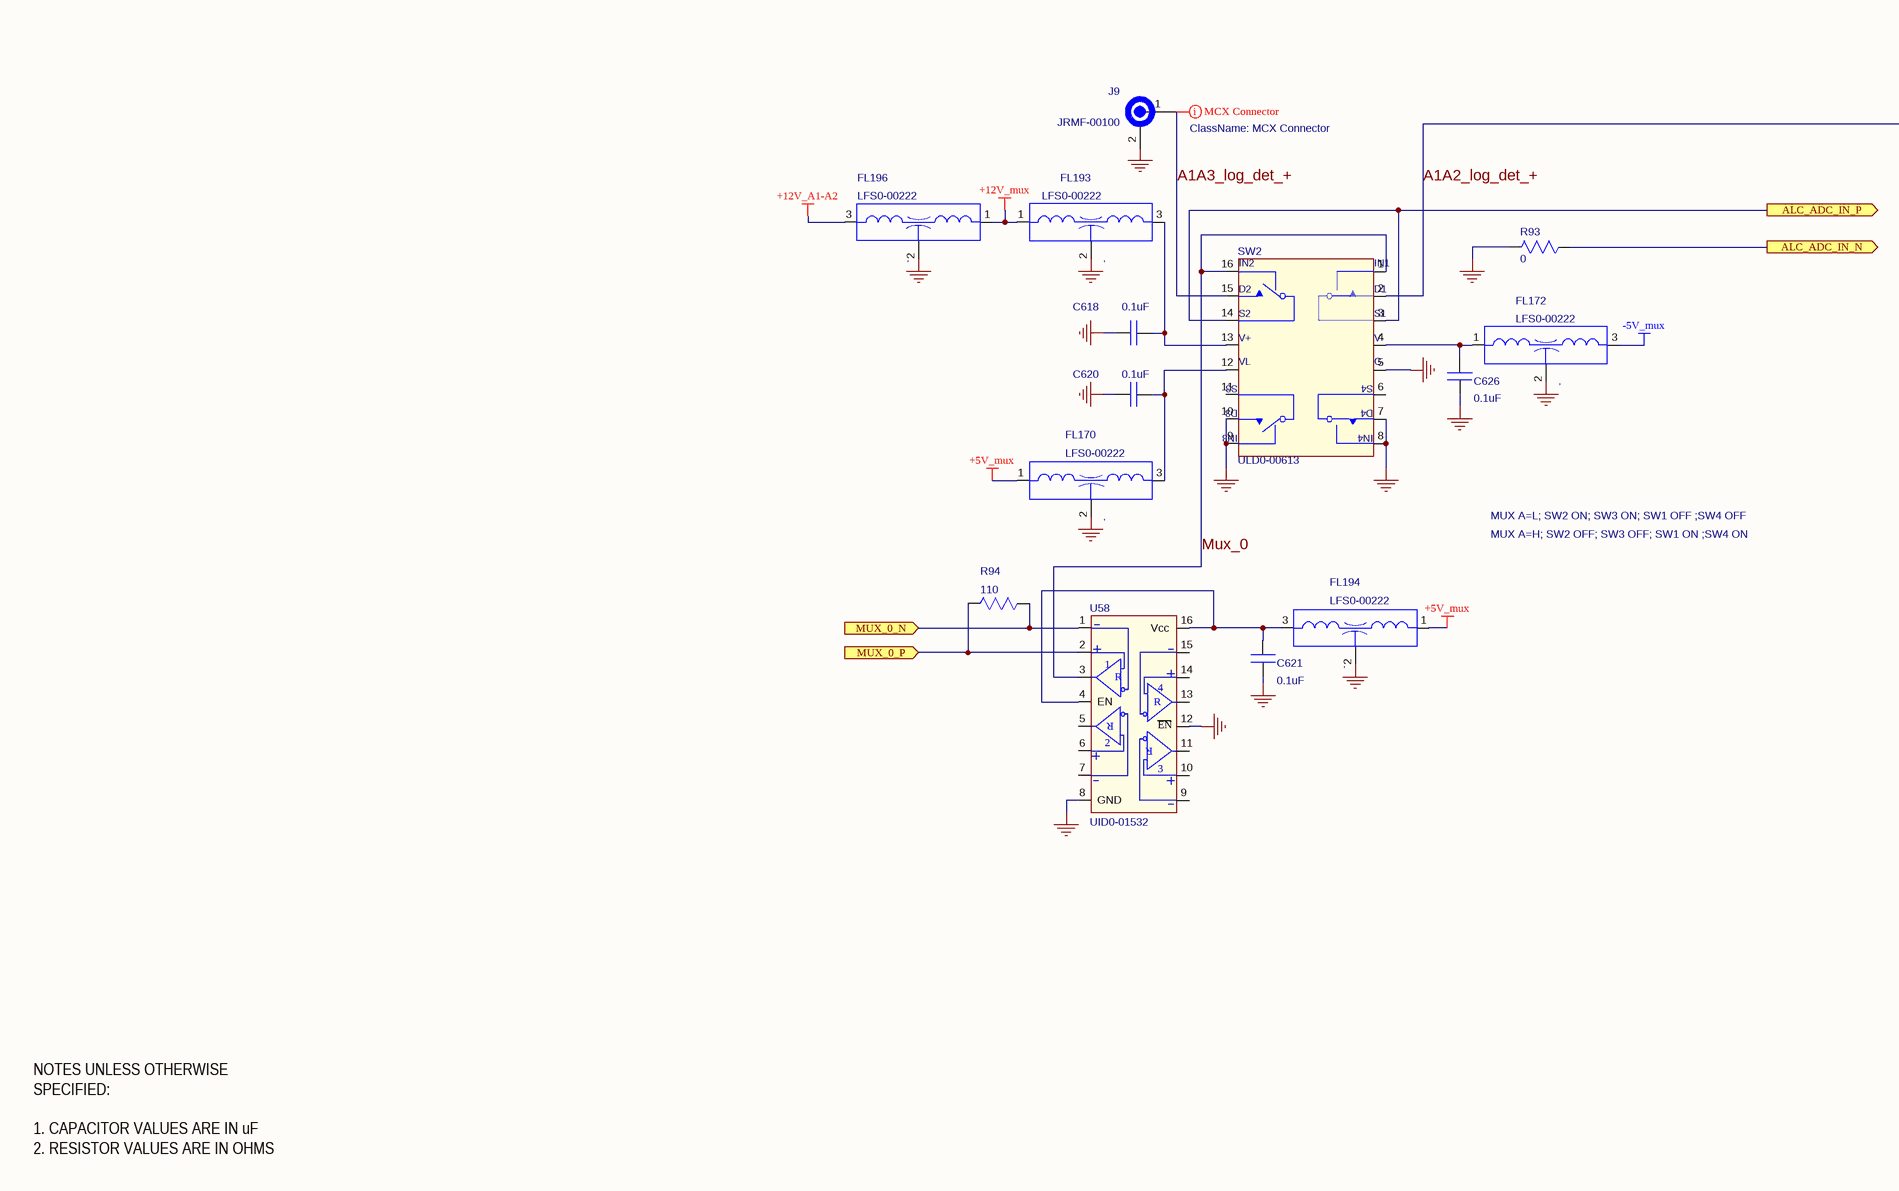
[diagram p31: Analog Mux.SchDoc, bottom left]
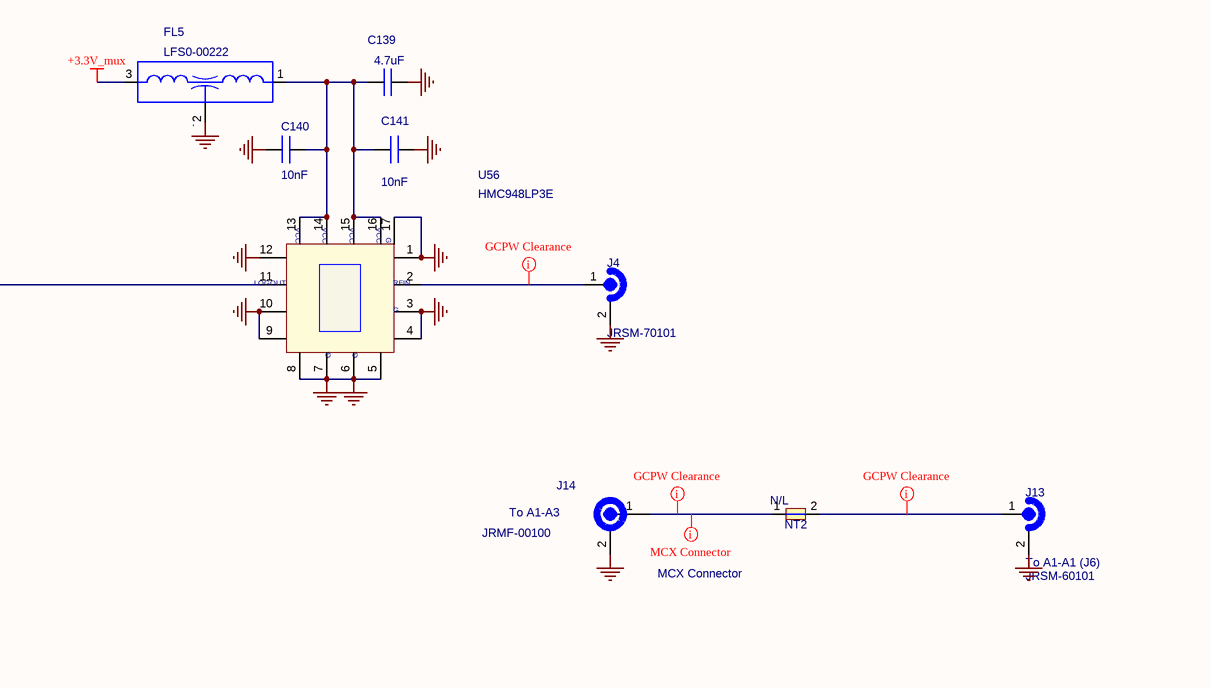
[diagram p32: Analog Mux.SchDoc, bottom right]

### Parts
C139  value 4.7uF  [CAP-0805-N]  (hidden comment: 4.7uF 25V X5R CHIP CERAMIC)
C140  value 10nF  [CAP-0402-N]  (hidden comment: 10nF;10%;X7R;16 WVDC;CHIP;0402)
C141  value 10nF  [CAP-0402-N]  (hidden comment: 10nF;10%;X7R;16 WVDC;CHIP;0402)
C230  value 2.2uF  [CAP-0603-H035-N]  (hidden comment: CAP,CHP,2.2UF,10%,X5R;16V)
C231  value 2.2uF  [CAP-0603-H035-N]  (hidden comment: CAP,CHP,2.2UF,10%,X5R;16V)
C618  value 0.1uF  [CAP-0805-N]  (hidden comment: .1UF;10%;X7R;>25V;CHIP;0805)
C619  value 0.1uF  [CAP-0805-N]  (hidden comment: .1UF;10%;X7R;>25V;CHIP;0805)
C620  value 0.1uF  [CAP-0805-N]  (hidden comment: .1UF;10%;X7R;>25V;CHIP;0805)
C621  value 0.1uF  [CAP-0603-H035-N]  (hidden comment: .1UF;10%;X7R;16V;CHIP;0603)
C624  value 2.2uF  [CAP-0603-H035-N]  (hidden comment: CAP,CHP,2.2UF,10%,X5R;16V)
C625  value 2.2uF  [CAP-0603-H035-N]  (hidden comment: CAP,CHP,2.2UF,10%,X5R;16V)
C626  value 0.1uF  [CAP-0805-N]  (hidden comment: .1UF;10%;X7R;>25V;CHIP;0805)
C991  value 0.1uF  [CAP-0402-N]  (hidden comment: .1 UF,10%;X7R;16V,CHIP;0402)
FL5  Filter EMI 2200PF,1206  [FIL-NFE31P-1206-4P]  (value not drawn)
FL168  Filter EMI 2200PF,1206  [FIL-NFE31P-1206-4P]  (value not drawn)
FL170  Filter EMI 2200PF,1206  [FIL-NFE31P-1206-4P]  (value not drawn)
FL172  Filter EMI 2200PF,1206  [FIL-NFE31P-1206-4P]  (value not drawn)
FL193  Filter EMI 2200PF,1206  [FIL-NFE31P-1206-4P]  (value not drawn)
FL194  Filter EMI 2200PF,1206  [FIL-NFE31P-1206-4P]  (value not drawn)
FL196  Filter EMI 2200PF,1206  [FIL-NFE31P-1206-4P]  (value not drawn)
FT5  AnalogMux  NoLoad: N/L  [FromToNode_ML2]  (net tie, no BOM)
FT20  Analog Mux  NoLoad: N/L  [FromToNode_ML2]  (net tie, no BOM)
FT23  Analog Mux  NoLoad: N/L  [FromToNode_ML2]  (net tie, no BOM)
J4  .  [JRSM-70101]  (value not drawn)
J6  Connector to A1-A3 interface  [JIB2-16310]
J9  A1A3 log det +  [JRMF-00100]  (value not drawn)
J13  To A1-A1 (J6)  [JRSM-60101]
J14  To A1-A3  [JRMF-00100]
NT2  NoLoad: N/L  [NET_TIE_10mil]  (hidden comment: NET TIE, 10 mil line)  (net tie, no BOM)
R93  value 0  [RES-0402-N]  (hidden comment: JUMPER;0 OHMS;SMT;0402)
R94  value 110  [RES-0402-N]  (hidden comment: 110 OHMS; 1%; .1W; 100PPM; FILM; CHIP; 0402)
R103  NoLoad: N/L  [RES-0402-N]  (hidden comment: 2.00K OHMS;.06W;1%;200PPM;FILM;CHIP;0402)
R104  NoLoad: N/L  [RES-0402-N]  (hidden comment: 2.00K OHMS;.06W;1%;200PPM;FILM;CHIP;0402)
R105  NoLoad: N/L  [RES-0402-N]  (hidden comment: JUMPER;0 OHMS;SMT;0402)
R106  NoLoad: N/L  [RES-0402-N]  (hidden comment: JUMPER;0 OHMS;SMT;0402)
R277  value 2.00K  NoLoad: N/L  [RES-0402-N]  (hidden comment: 2.00K OHMS;.06W;1%;200PPM;FILM;CHIP;0402)
R278  value 2.00K  NoLoad: N/L  [RES-0402-N]  (hidden comment: 2.00K OHMS;.06W;1%;200PPM;FILM;CHIP;0402)
R359  value 10.0K  [RES-0402-N]  (hidden comment: 10.0K OHMS;.06W;1%;200PPM;FILM;CHIP;0402)
R360  value 12.1k  [RES-0402-N]  (hidden comment: 12.1K OHMS;.06W;1%;200PPM;FILM;CHIP;0402)
R361  value 10.0K  [RES-0402-N]  (hidden comment: 10.0K OHMS;.06W;1%;200PPM;FILM;CHIP;0402)
R362  value 12.1k  [RES-0402-N]  (hidden comment: 12.1K OHMS;.06W;1%;200PPM;FILM;CHIP;0402)
R363  value 1.00K  [RES-0402-N]  (hidden comment: 1.0K OHMS;.06W;1%;200PPM;FILM;CHIP;0402)
R364  value 4.99K  [RES-0402-N]  (hidden comment: 4.99K OHMS;.06W;1%;200PPM;FILM;CHIP;0402)
R556  NoLoad: N/L  [RES-0402-N]  (hidden comment: 100 OHMS; 1%; .1W; 100PPM; FILM; CHIP; 0402)
SW2  QUAD SPST ANALOG SW;200NS;45 OHM;SO-16  [SOIC-16_Vishay]  (value not drawn)
U56  M_PN: HMC948LP3E  [QFN-16_HITTITE_LP3]  (hidden comment: LOG DETECTOR;1-23 GHz;54dB DYNAMIC RANGE;3x3 mm SMT)
U58  UID0-01532  [MTC16]
U60  OP-AMP;DUAL:PRECISION;LOW CURRENT;LOW NOISE;WIDE  [SO8_MS-012]  (value not drawn)  (parts A,B of 2)
U61  M_PN: AD590  [TO-52]  (hidden comment: IC; 2-Terminal; Temperature Transducer)
U65  M_PN: LTC2487CDE#PBF  [DFN14-LINEAR]  (hidden comment: ADC;16-BIT;2/4 CHANNEL;12SPS;INT REF;5V SUP;QFN14)

### Ports
A1-A3_EXT_INPUT_CTRL, A1-A3_FILTER_A, A1-A3_FILTER_B, A1-A3_FILTER_C, A1-A3_PULSE_MOD, A1_I2C_CLK_BUF, A1_I2C_DATA_BUF, ALC_ADC_IN_N, ALC_ADC_IN_P, ALC_VAR_ATTN_LOBAND_IOUT_N, ALC_VAR_ATTN_LOBAND_IOUT_P, MUX_0_N, MUX_0_P

### Nets
+3.3V_mux: FL5.3(OUT)
+5V_A1-A3: C231.1 C624.1 FT23.1 J6.1 U60.8(V+)
+5V_mux: C991.2 FL168.3(OUT) FL170.1(IN) FL194.1(IN) FT20.1 R103.2 R104.2 R277.2 R278.2 U61.1(+)
+12V_A1-A2: FL196.3(OUT)
+12V_mux: FL193.1(IN) FL196.1(IN)
-5V_A1-A3: C230.1 C625.1 FT5.1 J6.15 U60.4(V-)
-5V_mux: FL172.3(OUT)
GND: C139.1 C140.1 C141.1 C230.2 C231.2 C618.1 C619.1 C620.1 C621.2 C624.2 C625.2 C626.1 C991.1 FL5.2(GND) FL168.2(GND) FL170.2(GND) FL172.2(GND) FL193.2(GND) FL194.2(GND) FL196.2(GND) J4.2(GND) J6.4 J6.6 J6.8 J6.10 J6.12 J6.14 J6.16 J9.2(GND) J13.2(GND) J14.2(GND) R93.1 R105.2 R106.2 R360.2 R364.1 R556.2 SW2.5(G) SW2.7(D4) SW2.8(IN4) SW2.9(IN3) SW2.10(D3) U56.1(NC) U56.3(G) U56.4(NC) U56.5(NC) U56.6(G) U56.7(G) U56.8(NC) U56.9(NC) U56.10(NC) U56.12(NC) U56.17(GND) U58.8(GND) U58.12(EN_Rev) U65.1(F0) U65.6(GND) U65.7(COM) U65.10(CH2) U65.11(CH3) U65.14(REF-) U65.15(PADDLE)
A1-A3_VVA: J6.11 R362.1 U60.1(OUT)
A1_I2C_CLK_BUF: R277.1 U65.4(SCL) ; port A1_I2C_CLK_BUF
A1_I2C_DATA_BUF: R278.1 U65.5(SCD) ; port A1_I2C_DATA_BUF
A1A1_temp_out: R363.2 U65.8(CH0)
A1A2_log_det_+: SW2.2(D1) U56.11(LOGOUT)
A1A3_log_det_+: J9.1 SW2.15(D2)
A1A3_temp_out: J6.2 U65.9(CH1)
ALC_ADC_IN_N: R93.2 ; port ALC_ADC_IN_N
ALC_ADC_IN_P: SW2.3(S1) SW2.14(S2) ; port ALC_ADC_IN_P
ALC_VAR_ATTN_LOBAND_IOUT_N: R359.2 ; port ALC_VAR_ATTN_LOBAND_IOUT_N
ALC_VAR_ATTN_LOBAND_IOUT_P: R361.2 ; port ALC_VAR_ATTN_LOBAND_IOUT_P
Mux_0: SW2.1(IN1) SW2.16(IN2) U58.3(Rout1)
MUX_0_N: R94.2 U58.1(Rin1-) ; port MUX_0_N
MUX_0_P: R94.1 U58.2(Rin1+) ; port MUX_0_P
NetC139_2: C139.2 C140.2 C141.2 FL5.1(IN) U56.13(VCC) U56.14(VCC) U56.15(NC) U56.16(VCC)
NetC618_2: C618.2 FL193.3(OUT) SW2.13(V+)
NetC619_2: C619.2 FL168.1(IN) U65.12(VCC) U65.13(REF+)
NetC620_2: C620.2 FL170.3(OUT) SW2.12(VL)
NetC621_1: C621.1 FL194.3(OUT) U58.4(EN) U58.16(Vcc)
NetC626_2: C626.2 FL172.1(IN) SW2.4(V-)
NetJ4_1: J4.1(CNTR) U56.2(RFIN)
NetJ6_3: J6.3 ; port A1-A3_FILTER_C
NetJ6_5: J6.5 ; port A1-A3_FILTER_B
NetJ6_7: J6.7 ; port A1-A3_FILTER_A
NetJ6_9: J6.9 ; port A1-A3_EXT_INPUT_CTRL
NetJ6_13: J6.13 R556.1 ; port A1-A3_PULSE_MOD
NetJ13_1: J13.1(CNTR) NT2.2
NetJ14_1: J14.1 NT2.1
NetR103_1: R103.1 R105.1 U65.2(CA0)
NetR104_1: R104.1 R106.1 U65.3(CA1)
NetR359_1: R359.1 R360.1 U60.3(+IN)
NetR361_1: R361.1 R362.2 U60.2(-IN)
NetR363_1: R363.1 U60.6(-IN) U60.7(OUT)
NetR364_2: R364.2 U60.5(+IN) U61.2(-)

Not connected (* = marked no-connect by the designer): SW2 6(S4) 11(S3); U58 5(Rout2) 6(Rin2+) 7(Rin2-) 9(Rin3-) 10(Rin3+) 11(Rout3) 13(Rout4) 14(Rin4+) 15(Rin4-)

### Layout directives
net class GCPW Clearance: NetJ4_1, NetJ13_1, NetJ14_1
net class MCX Connector: A1A3_log_det_+, NetJ14_1
net class VVA2: A1-A3_VVA

### Notes on the sheet
- A1-A3 DIGITAL AND ANALOG INTERFACE
- ANALOG MULTIPLEXER FOR A1-A2 AND A1-A3 LOG DETECTOR OUTPUTS
- (near C231) 0V - 5V
- 0V - 3.3V
- MUX A=L; SW2 ON; SW3 ON; SW1 OFF ;SW4 OFF
- MUX A=H; SW2 OFF; SW3 OFF; SW1 ON ;SW4 ON
- NOTES UNLESS OTHERWISE SPECIFIED:
  1. CAPACITOR VALUES ARE IN uF
  2. RESISTOR VALUES ARE IN OHMS
- Title
- Sheet Title
- PRINTED DOCUMENT IS CONSIDERED UNCONTROLLED. VERIFY REVISION IN PLM SYSTEM.
- THIS DOCUMENT CONTAINS PROPRIETARY INFORMATION. DESIGN RIGHTS BELONG TO GIGA-TRONICS AND MAY NOT BE REPRODUCED WITHOUT WRITTEN AUTHORIZATION FOR ANY REASON EXCEPT CALIBRATION, OPERATION AND MAINTENANCE.
- Size
- CAGE CODE
- Filename
- D
- Document Number
- 58900
- Date
- Sheet
- Rev
- of
- (in symbol LFS0-00222) ,
- (in symbol UFD0-08620, part A) +; +Vs; -Vs; -
- (in symbol UFD0-08620, part B) +; -
- (in symbol UID0-01532) R

### Library data of the parts
C139 = CK50-15470: Approved: CL; NoLoad: .; MFGR: ANY; level: 1; line_number: 280; ModifyDate: 02/26/203; M_PN: ANY; G_PN: CK50-15470; item_number: CK50-15470
C140 C141 = TCC3-03100: Approved: CL; MFGR: ATC; M_PN: ATC520L103KT16T; NoLoad: .; level: 1; line_number: 90; ModifyDate: 4/26/13; G_PN: TCC3-03100; item_number: TCC3-03100
C230 C231 C624 C625 = CK45-05220: Approved: CL; NoLoad: .; MFGR: ANY; level: 1; line_number: 113; ModifyDate: 4/30/15; G_PN: CK45-05220; M_PN: ANY; item_number: CK45-05220
C618-C620 C626 = CK50-04100: Approved: CL; NoLoad: .; MFGR: ANY; level: 1; line_number: 250; G_PN: CK50-04100; ModifyDate: 02/22/12; M_PN: ANY; item_number: CK50-04100
C621 = CK45-04100: as C293 on sheet Fast PLL; ModifyDate: 02/22/12; G_PN: CK45-04100; M_PN: ANY; item_number: CK45-04100
C991 = CK40-04100: as C27 on sheet Fast PLL; G_PN: CK40-04100; ModifyDate: 3/29/13; item_number: CK40-04100
FL5 FL168 FL170 FL172 FL193 FL194 FL196 = LFS0-00222: as FL14 on sheet Fast PLL; G_PN: LFS0-00222; ModifyDate: 02/22/12; Value: 2200pF; item_number: LFS0-00222
FT5 FT20 FT23 = FromToNode: level: 1; Approved: *; G_PN: *; MFGR: *; Value: *
J4 = JRSM-70101: SMPM FD MALE,STRAIGHT SMT, R/A COPLANAR, 4 PIN THRU-HOLE; Value: B012-P93-02; MFGR: GILBERT; Approved: CL; level: 1; line_number: 480; M_PN: B012-P93-02; NoLoad: .; ModifyDate: 10/15/14; G_PN: JRSM-70101; item_number: JRSM-70101
J6 = JIB2-16310: STRIPLINE SOCKET;2MM CTR;2X8 PIN;.31" HT; M_PN: ESQT-108-03-G-D-310; Approved: NM; NoLoad: .; MFGR: SAMTEC; level: 1; line_number: 500; ModifyDate: 12/05/12; G_PN: JIB2-16310; item_number: JIB2-16310
J9 J14 = JRMF-00100: MCX F;PC MOUNT;STRAIGHT;.1 LEADSP; M_PN: R-113-427-000; MFGR: RADIAL; Approved: NM; NoLoad: .; level: 1; line_number: 510; ModifyDate: 12/30/12; G_PN: JRMF-00100; item_number: JRMF-00100
J13 = JRSM-60101: SMPM SM MALE,STRAIGHT SMT, R/A COPLANAR, 4 PIN THRU-HOLE; Value: B012-P95-02; MFGR: GILBERT; Approved: CL; NoLoad: .; level: 1; line_number: 483; M_PN: B012-P95-02; ModifyDate: 1/6/14; G_PN: JRSM-60101; item_number: JRSM-60101
NT2 = NET_TIE_10mil: Approved: CL; level: 1
R93 = RK35-00000: Approved: CL; NoLoad: .; MFGR: ANY; level: 1; line_number: 1005; G_PN: RK35-00000; ModifyDate: 02/22/12; M_PN: ANY; item_number: RK35-00000
R94 = RK35-01100: Approved: CL; NoLoad: .; MFGR: ANY; level: 1; line_number: 1055; ModifyDate: 02/22/12; G_PN: RK35-01100; M_PN: ANY; item_number: RK35-01100
R103 R104 R277 R278 = RK35-12000: MFGR: ANY; Approved: CL; level: 1; line_number: 660; G_PN: RK35-12000; ModifyDate: 02/22/12; M_PN: ANY; item_number: RK35-12000
  R103 R104: Value: 2.00K
R105 R106 = RK35-00000: MFGR: ANY; Approved: CL; Value: 0; level: 1; line_number: 1005; G_PN: RK35-00000; ModifyDate: 02/22/12; M_PN: ANY; item_number: RK35-00000
R359 R361 = RK35-21000: Approved: CL; NoLoad: .; MFGR: ANY; level: 1; line_number: 700; G_PN: RK35-21000; ModifyDate: 02/22/12; M_PN: ANY; item_number: RK35-21000
R360 R362 = RK35-21210: Approved: CL; NoLoad: .; MFGR: ANY; level: 1; line_number: 852; G_PN: RK35-21210; ModifyDate: 4/26/13; M_PN: ANY; item_number: RK35-21210
R363 = RK35-11000: as R776 on sheet Fast PLL; G_PN: RK35-11000; ModifyDate: 02/22/12; M_PN: ANY; item_number: RK35-11000
R364 = RK35-14990: Approved: CL; NoLoad: .; MFGR: ANY; level: 1; line_number: 720; G_PN: RK35-14990; ModifyDate: 4/11/12; M_PN: ANY; item_number: RK35-14990
R556 = RK35-01000: Approved: CL; MFGR: ANY; Value: 100; level: 1; line_number: 960; G_PN: RK35-01000; ModifyDate: 02/22/12; M_PN: ANY; item_number: RK35-01000
SW2 = ULD0-00613: as SW1 on sheet Fast PLL; ModifyDate: 2/20/13; M_PN: DG613DY; G_PN: ULD0-00613; item_number: ULD0-00613
U56 = MD00-00123: MFGR: HITTITE; Approved: CL; Value: HMC948LP3E; NoLoad: .; level: 1; line_number: 1255; ModifyDate: 4/26/13; G_PN: MD00-00123; item_number: MD00-00123
U58 = UID0-01532: FIN1532 5V LVDS 4-Bit High Speed Differential Receiver;16-Lead TSSOP Package; MFGR: Fairchild Semiconductor; NoLoad: .; Approved: XiaoXiao; level: 1; line_number: 1215; ModifyDate: 07/31/2012; M_PN: FIN1532; G_PN: UID0-01532; item_number: UID0-01532
U60 = UFD0-08620: Value: AD8620; NoLoad: .; Approved: CL; MFGR: ANALOG DEVICES; level: 1; line_number: 1200; ModifyDate: 02/20/13; M_PN: AD8620; G_PN: UFD0-08620; item_number: UFD0-08620
U61 = 18729: NoLoad: .; Approved: NM; MFGR: ANALOG DEVICES; level: 1; line_number: 1260; G_PN: 18729; ModifyDate: 12/06/12; item_number: 18729
U65 = UID0-02487: Value: LTC2487CDE#PBF; NoLoad: .; Approved: CL; MFGR: LINEAR TECHNOLOGY; level: 1; line_number: 1265; ModifyDate: 3/27/13; G_PN: UID0-02487; item_number: UID0-02487